# EAGLE design Domino USB MicroSD No Teardrop New (EAGLE 6.5.0)
DATABASE: ./../Common/BOM/Domino_DB.txt; DRAWN: M.STEMPIN; REV: B
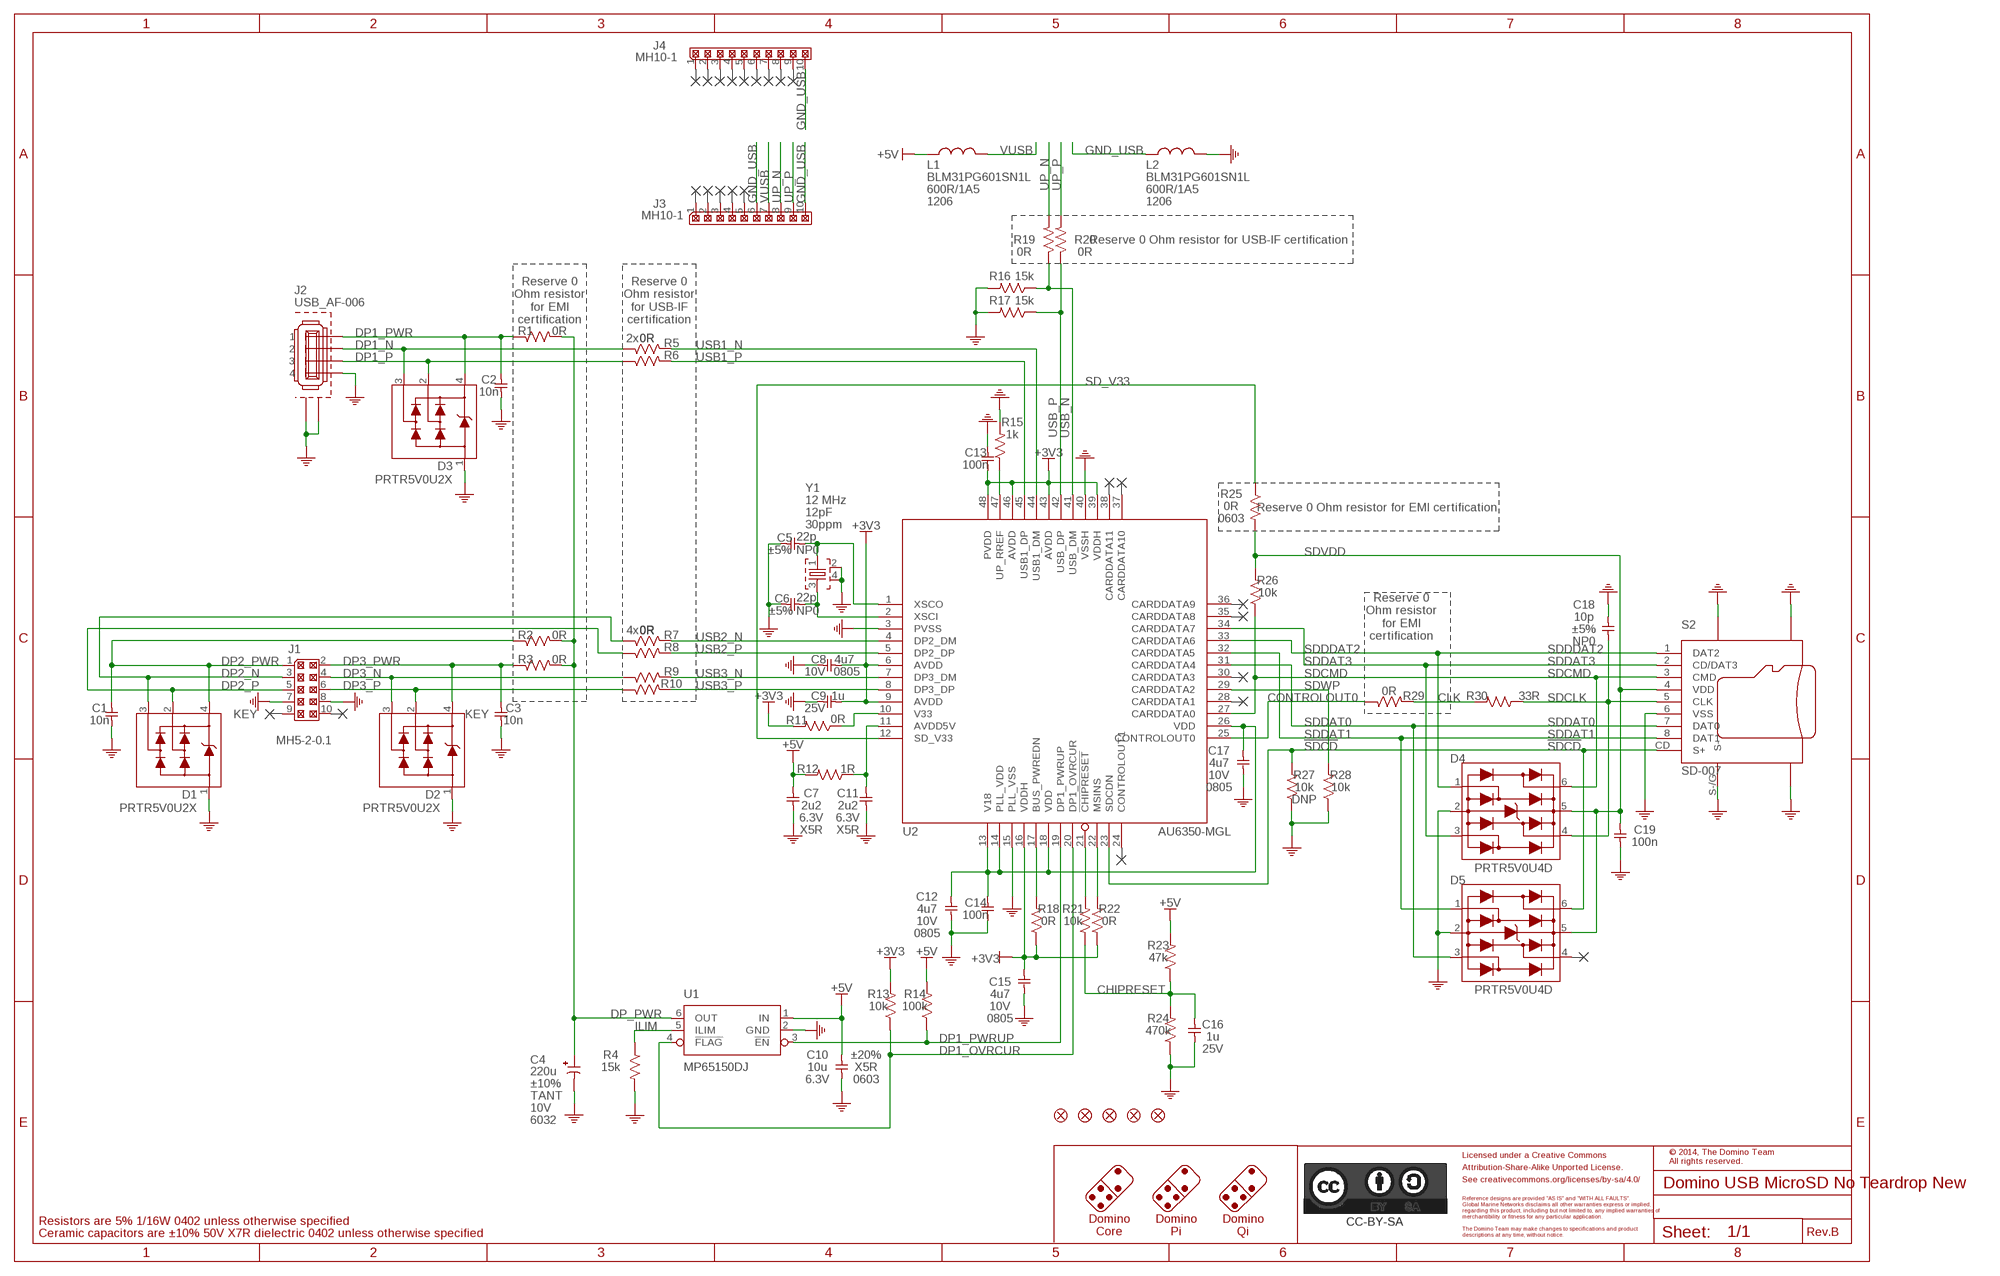
[diagram p0: schematic, sheet 1]
PORT1 (NC): BOM: EXCLUDE
PORT2 (NC): BOM: EXCLUDE
PORT3 (NC): BOM: EXCLUDE
PORT4 (NC): BOM: EXCLUDE
PORT5 (NC): BOM: EXCLUDE
PORT6 (NC): BOM: EXCLUDE
PORT7 (NC): BOM: EXCLUDE
PORT8 (NC): BOM: EXCLUDE
PORT9 (NC): BOM: EXCLUDE
PORT10 (NC): BOM: EXCLUDE
PORT11 (NC): BOM: EXCLUDE
PORT12 (NC): BOM: EXCLUDE
PORT13 (NC): BOM: EXCLUDE
PORT14 (NC): BOM: EXCLUDE
PORT15 (NC): BOM: EXCLUDE
PORT16 (NC): BOM: EXCLUDE
PORT17 (NC): BOM: EXCLUDE
PORT18 (NC): BOM: EXCLUDE
PORT19 (NC): BOM: EXCLUDE
PORT22 (NC): BOM: EXCLUDE
PORT23 (NC): BOM: EXCLUDE
PORT24 (NC): BOM: EXCLUDE
PORT25 (NC): BOM: EXCLUDE
PORT26 (NC): BOM: EXCLUDE

## Parts
C1  10n  CAP_0402  [C0402]
C2  10n  CAP_0402  [C0402]
C3  10n  CAP_0402  [C0402]
C4  220u  CPOL_C/6032-25  [C/6032-25]
C5  22p  CAP_0402  [C0402]
C6  22p  CAP_0402  [C0402]
C7  2u2  CAP_0402  [C0402]
C8  4u7  CAP_0805  [C0805]
C9  1u  CAP_0402  [C0402]
C10  10u  CAP_0603  [C0603]
C11  2u2  CAP_0402  [C0402]
C12  4u7  CAP_0805  [C0805]
C13  100n  CAP_0402  [C0402]
C14  100n  CAP_0402  [C0402]
C15  4u7  CAP_0805  [C0805]
C16  1u  CAP_0402  [C0402]
C17  4u7  CAP_0805  [C0805]
C18  10p  CAP_0402  [C0402]
C19  100n  CAP_0402  [C0402]
CC-BY-SA1  CC-BY-SA_LOGO  [CC-BY-SA_LOGO]
D1  PRTR5V0U2X  [SOT143B]
D2  PRTR5V0U2X  [SOT143B]
D3  PRTR5V0U2X  [SOT143B]
D4  PRTR5V0U4D  [SOT23-6]
D5  PRTR5V0U4D  [SOT23-6]
F1  FIDUCIAL  [FIDUCIAL]
F2  FIDUCIAL  [FIDUCIAL]
F4  FIDUCIAL  [FIDUCIAL]
F5  FIDUCIAL  [FIDUCIAL]
F6  FIDUCIAL  [FIDUCIAL]
J1  MH5-2-0.1  MH5-2  [MH05-2-0.1]
J2  USB_AF-006  [USB_AF-006]
J3  MH10-1  [MH10-1-0.1]
J4  MH10-1  [MH10-1-0.1]
L1  BLM31PG601SN1L  FB_1206  [FB1206]
L2  BLM31PG601SN1L  FB_1206  [FB1206]
R1  0R  RES_0402  [R0402]
R2  0R  RES_0402  [R0402]
R3  0R  RES_0402  [R0402]
R4  15k  RES_0402  [R0402]
R5  0R  RES_0402  [R0402]
R6  0R  RES_0402  [R0402]
R7  0R  RES_0402  [R0402]
R8  0R  RES_0402  [R0402]
R9  0R  RES_0402  [R0402]
R10  0R  RES_0402  [R0402]
R11  0R  RES_0402  [R0402]
R12  1R  RES_0402  [R0402]
R13  10k  RES_0402  [R0402]
R14  100k  RES_0402  [R0402]
R15  1k  RES_0402  [R0402]
R16  15k  RES_0402  [R0402]
R17  15k  RES_0402  [R0402]
R18  0R  RES_0402  [R0402]
R19  0R  RES_0402  [R0402]
R20  0R  RES_0402  [R0402]
R21  10k  RES_0402  [R0402]
R22  0R  RES_0402  [R0402]
R23  47k  RES_0402  [R0402]
R24  470k  RES_0402  [R0402]
R25  0R  RES_0603  [R0603]
R26  10k  RES_0402  [R0402]
R27  10k  RES_0402  [R0402]
R28  10k  RES_0402  [R0402]
R29  0R  RES_0402  [R0402]
R30  33R  RES_0402  [R0402]
S2  SD-007  MICRO-SD  [SD-007]
U1  MP65150DJ  [SOT23-6]
U2  AU6350-MGL  [LQFP-48_7X7]
Y1  12 MHz  CRYSTAL_2SH  [CRYSTAL_32X25]

## Nets
!CHIPRESET: R21.2 U2.21(!CHIPRESET)
!SDCD: D5.6(I/O4) R27.2 S2.CD(S+) U2.23(SDCDN)
+3V3: C8.2 C9.2 C13.2 C15.2 R11.2 R13.2 R18.1 R22.1 U2.6(AVDD) U2.9(AVDD) U2.16(VDDH) U2.39(VDDH) U2.43(AVDD) U2.46(AVDD) U2.48(PVDD)
+5V: C7.1 C10.1 L1.2 R12.2 R14.2 R23.2 U1.1(IN)
AVDD5V: C11.1 R12.1 U2.11(AVDD5V)
BUS_PWREDN: R18.2 U2.17(BUS_PWREDN)
CHIPRESET: C16.1 R21.1 R23.1 R24.2
CLK: R29.2 R30.2
CONTROLOUT0: R29.1 U2.25(CONTROLOUT0)
DP1_N [USB]: D3.3 J2.2 R5.1
DP1_OVRCUR: R13.1 U1.4(!FLAG) U2.20(DP1_OVRCUR)
DP1_P [USB]: D3.2 J2.3 R6.1
DP1_PWR: C2.1 D3.4 J2.1 R1.1
DP1_PWRUP: R14.1 U1.3(!EN) U2.19(DP1_PWRUP)
DP2_N [USB]: D1.3 J1.3 R7.1
DP2_P [USB]: D1.2 J1.5 R8.1
DP2_PWR: C1.1 D1.4 J1.1 R2.1
DP3_N [USB]: D2.3 J1.4 R9.1
DP3_P [USB]: D2.2 J1.6 R10.1
DP3_PWR: C3.1 D2.4 J1.2 R3.1
DP_PWR: C4.1(+) R1.2 R2.2 R3.2 U1.6(OUT)
GND: C1.2 C2.2 C3.2 C4.2(-) C5.1 C6.1 C7.2 C8.1 C9.1 C10.2 C11.2 C12.1 C13.1 C14.2 C15.1 C16.2 C17.1 C18.2 C19.2 D1.1 D2.1 D3.1 D4.2(GND) D5.2(GND) J1.7 J1.8 J2.4 J2.S$1(G) J2.S$2(G) L2.1 R4.2 R15.2 R16.2 R17.2 R24.1 R27.1 R28.1 S2.6(VSS) S2.G$1(G) S2.G$2(G) S2.G$3(G) S2.S-/G(S-) U1.2(GND) U2.3(PVSS) U2.15(PLL_VSS) U2.40(VSSH) Y1.2 Y1.4
GND_USB: J3.6 J3.10 J4.10 L2.2
ILIM: R4.1 U1.5(ILIM)
MSINS: R22.2 U2.22(MSINS)
SD_V33: R25.1 U2.12(SD_V33)
SDCLK: C18.1 D4.4(I/O3) R30.1 S2.5(CLK)
SDCMD: D4.6(I/O4) R26.1 S2.3(CMD) U2.27(CARDDATA0)
SDDAT0: D5.3(I/O2) S2.7(DAT0) U2.31(CARDDATA4)
SDDAT1: D5.1(I/O1) S2.8(DAT1) U2.32(CARDDATA5)
SDDAT3: D4.3(I/O2) S2.2(CD/DAT3) U2.34(CARDDATA7)
SDDDAT2: D4.1(I/O1) S2.1(DAT2) U2.33(CARDDATA6)
SDVDD: C19.1 D4.5(VCC) D5.5(VCC) R25.2 R26.2 S2.4(VDD)
SDWP: R28.2 U2.29(CARDDATA2)
UP_N [USB]: J3.8 R19.2
UP_P [USB]: J3.9 R20.2
UP_PREF: R15.1 U2.47(UP_RREF)
USB1_N [USB]: R5.2 U2.44(USB1_DM)
USB1_P [USB]: R6.2 U2.45(USB1_DP)
USB2_N [USB]: R7.2 U2.4(DP2_DM)
USB2_P [USB]: R8.2 U2.5(DP2_DP)
USB3_N [USB]: R9.2 U2.7(DP3_DM)
USB3_P [USB]: R10.2 U2.8(DP3_DP)
USB_N [USB]: R16.1 R19.1 U2.41(USB_DM)
USB_P [USB]: R17.1 R20.1 U2.42(USB_DP)
V18: C12.2 C14.1 C17.2 U2.13(V18) U2.14(PLL_VDD) U2.18(VDD) U2.26(VDD)
V33: R11.1 U2.10(V33)
VUSB: J3.7 L1.1
XSCI: C6.2 U2.2(XSCI) Y1.3
XSCO: C5.2 U2.1(XSCO) Y1.1
Unconnected: D5.4(I/O3) J1.9 J1.10 J3.1 J3.2 J3.3 J3.4 J3.5 J4.1 J4.2 J4.3 J4.4 J4.5 J4.6 J4.7 J4.8 J4.9 U2.24(CONTROLOUT1) U2.28(CARDDATA1) U2.30(CARDDATA3) U2.35(CARDDATA8) U2.36(CARDDATA9) U2.37(CARDDATA10) U2.38(CARDDATA11)

## Notes on the sheet
- Reserve 0 Ohm resistor for USB-IF certification
- Reserve 0
  Ohm resistor
  for EMI
  certification
- Reserve 0
  Ohm resistor
  for USB-IF
  certification
- 2x
- Reserve 0 Ohm resistor for EMI certification
- Reserve 0
  Ohm resistor
  for EMI
  certification
- 4x
- KEY | KEY
- Licensed under a Creative Commons
- © 2014, The Domino Team
  All rights reserved.
- Attribution-Share-Alike Unported License.
- See creativecommons.org/licenses/by-sa/4.0/
- Reference designs are provided "AS IS" and "WITH ALL FAULTS".
- Global Marine Networks disclaims all other warranties express or implied,
- regarding this product, including but not limited to, any implied warranties of
- merchantibility or fitness for any particular application.
- Resistors are 5% 1/16W 0402 unless otherwise specified
- Domino
  Core
- Domino
  Pi
- Domino
  Qi
- The Domino Team may make changes to specifications and product
- Ceramic capacitors are ±10% 50V X7R dielectric 0402 unless otherwise specified | descriptions at any time, without notice. | Rev.

## Library data of the parts
C1-C3 = Domino:CAP_: Capacitor; PARTNO: C0402_10n_X7R_10%_CER_50V; SIZE: 0402; TC: X7R; TOL: ±10%; TYPE: CER; VOLT: 50V
C4 = Domino:CPOL_?*: Polarized Capacitor; PARTNO: CPOLC-6032_220u_20%_TANT_10V; SIZE: 6032; TOL: ±10%; TYPE: TANT; VOLT: 10V
C5 C6 = Domino:CAP_: Capacitor; PARTNO: C0402_22p_NP0_5%_CER_50V; SIZE: 0402; TC: NP0; TOL: ±5%; TYPE: CER; VOLT: 50V
C7 C11 = Domino:CAP_: Capacitor; PARTNO: C0402_2u2_X5R_10%_CER_6V3; SIZE: 0402; TC: X5R; TOL: ±10%; TYPE: CER; VOLT: 6.3V
C8 C12 C15 C17 = Domino:CAP_: Capacitor; PARTNO: C0805_4u7_X7R_10%_CER_6V3; SIZE: 0805; TC: X7R; TOL: 10%; TYPE: CER; VOLT: 10V
C9 C16 = Domino:CAP_: Capacitor; PARTNO: C0402_1u_X7R_10%_CER_25V; SIZE: 0402; TC: X7R; TOL: ±10%; TYPE: CER; VOLT: 25V
C10 = Domino:CAP_: Capacitor; PARTNO: C0603_10u_X5R_20%_CER_6V3; SIZE: 0603; TC: X5R; TOL: ±20%; TYPE: CER; VOLT: 6.3V
C13 C14 C19 = Domino:CAP_: Capacitor; PARTNO: C0402_100n_X7R_10%_CER_50V; SIZE: 0402; TC: X7R; TOL: ±10%; TYPE: CER; VOLT: 50V
C18 = Domino:CAP_: Capacitor; PARTNO: C0402_10p_NP0_5%_CER_50V; SIZE: 0402; TC: NP0; TOL: ±5%; TYPE: CER; VOLT: 50V
CC-BY-SA1 = Domino:CC-BY-SA_LOGO: Attribution-Share-Alike Unported License See creativecommons.org/licenses/by-sa/3.0/ for details.; BOM: EXCLUDE
D1-D3 = Domino:PRTR5V0U2X: Ultra low capacitance double rail-to-rail ESD protection diode; PARTNO: PRTR5V0U2X
D4 D5 = Domino:PRTR5V0U4D: Ultra low capacitance quadruple rail-to-rail ESD protection; PARTNO: PRTR5V0U4D
F1 F2 F4-F6 = Domino:FIDUCIAL: Fiducial Mark; BOM: EXCLUDE
J1 = Domino:MH5-2: 2x5 Pin Male Header; PARTNO: MH5-2-0.1
J2 = Domino:USB_AF-006: USB-A Right/Angle SMT Connector
J3 J4 = Domino:MH10-1: 10x1 Pin Male Header
L1 L2 = Domino:FB_: Ferrite Bead; OPT: 600R/1A5; PARTNO: BLM31PG601SN1L; SIZE: 1206
R1-R3 R5-R10 R18-R20 R22 R29 = Domino:RES_: Resistor; PARTNO: R0402_0R_5%_62.5mW; RATE: 62.5mW; SIZE: 0402; TOL: 5%
R4 R16 R17 = Domino:RES_: Resistor; PARTNO: R0402_15k_5%_62.5mW; RATE: 62.5mW; SIZE: 0402; TOL: 5%
R11 = Domino:RES_: Resistor; PARTNO: R0402_0R_5%_62.5mW; RATE: 125mW; SIZE: 0402; TOL: 5%
R12 = Domino:RES_: Resistor; PARTNO: R0402_1R_5%_62.5mW; RATE: 62.5mW; SIZE: 0402; TOL: 5%
R13 R21 R26 R28 = Domino:RES_: Resistor; PARTNO: R0402_10k_5%_62.5mW; RATE: 62.5mW; SIZE: 0402; TOL: 5%
R14 = Domino:RES_: Resistor; PARTNO: R0402_100k_5%_62.5mW; RATE: 62.5mW; SIZE: 0402; TOL: 5%
R15 = Domino:RES_: Resistor; PARTNO: R0402_1k_5%_62.5mW; RATE: 62.5mW; SIZE: 0402; TOL: 5%
R23 = Domino:RES_: Resistor; PARTNO: R0402_47k_5%_62.5mW; RATE: 62.5mW; SIZE: 0402; TOL: 5%
R24 = Domino:RES_: Resistor; PARTNO: R0402_470k_5%_62.5mW; RATE: 62.5mW; SIZE: 0402; TOL: 5%
R25 = Domino:RES_: Resistor; PARTNO: R0603_0R_5%_125mW; RATE: 125mW; SIZE: 0603; TOL: 5%
R27 = Domino:RES_: Resistor; DNP: T; PARTNO: R0402_10k_5%_62.5mW; RATE: 62.5mW; SIZE: 0402; TOL: 5%
R30 = Domino:RES_: Resistor; PARTNO: R0402_33R_5%_62.5mW; RATE: 62.5mW; SIZE: 0402; TOL: 5%
S2 = Domino:MICRO-SD: Micro SD Memory Card Connector, With Card Detect Switch; PARTNO: SD-007
U1 = Domino:MP65150DJ: Precision 60mA-1.7A Programmable Current-Limited Power Distribution Switch; PARTNO: MP65150DJ
U2 = Domino:AU6350-MGL: USB2.0 Hub-Reader Controller
Y1 = Domino:CRYSTAL_2SH: Crystal with 2 Shield Pins; LOAD: 12pF; PARTNO: CRYSTAL_32X25_2SH_12PF_30PPM; TOL: 30ppm

## Net classes
1 USB: width 0.368 mm, clearance 0.152 mm to class 0, clearance 0.152 mm
2 PoE: width 0.61 mm, clearance 0.13 mm to class 0, clearance 0.13 mm to class 1, clearance 0.13 mm

## Board
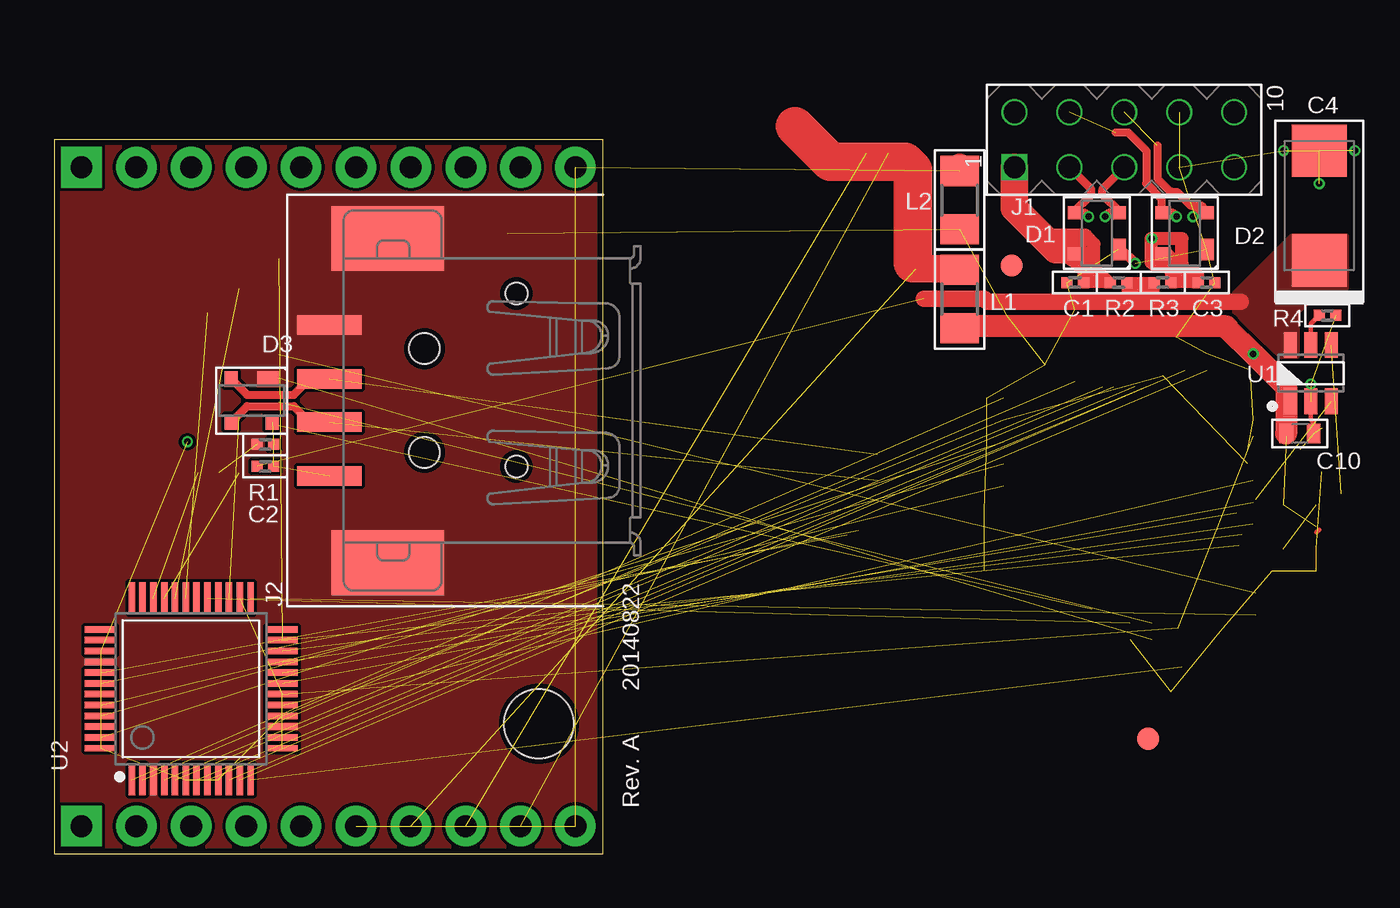
[diagram p1: board, top side]
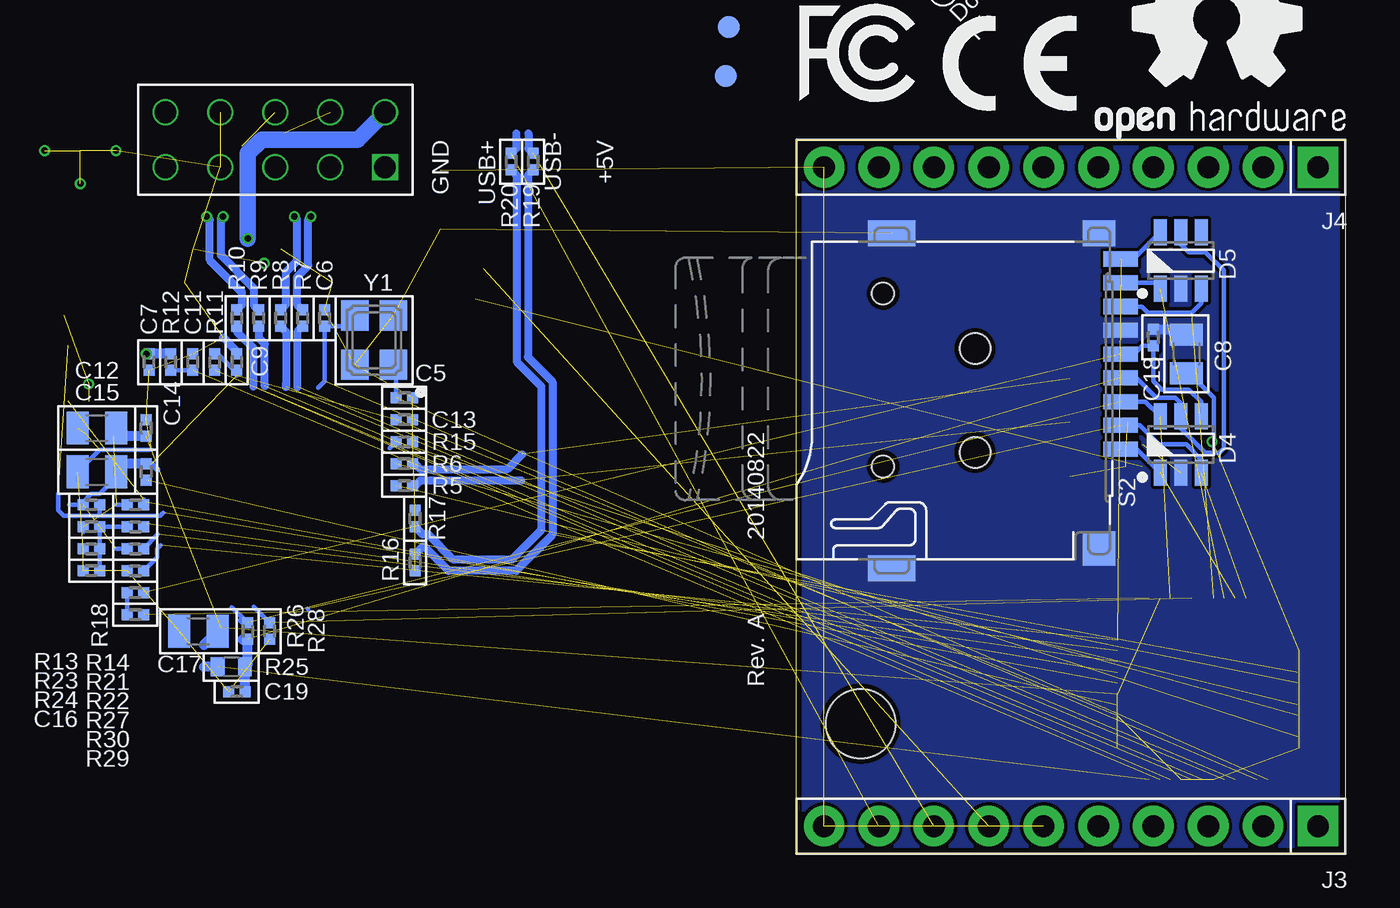
[diagram p2: board, bottom side, seen from below]

Size 25.4 x 33.02 mm. Coordinates in mm from the lower left corner, seen from the top.
Outline: 0,0 25.4,0 25.4,33.02 0,33.02 0,0
Copper layers (1*16): Top 0.043mm / dielectric 1mm / Bottom 0.043mm
Design rules "Domino": minimum track width 0.1mm, minimum drill 0.3mm, track to track 6mil, track to pad 6mil, pad to pad 6mil, via to via 6mil, smd to smd 0mil, copper to edge 0.25mm, drill to drill 0.35mm, minimum pad ring 0.085mm, minimum via ring 0.1mm, stop-mask expansion 0mil, vias tented up to drill 0.45mm, thermal gap 0.2mm
Holes 3.2 mm at 22.44,6

### Footprints (pad centres in the part's own frame; a part is rotated, then mirrored left to right if it is on the bottom)
C0402 = smd 0.508 x 0.508: 1 -0.381,0; 2 0.381,0
C/6032-25 = smd 2.413 x 2.54: 1 -2.54,0; 2 2.54,0
C0805 = smd 1.016 x 1.524: 1 -0.889,0; 2 0.889,0
C0603 = smd 0.635 x 0.889: 1 -0.635,0; 2 0.635,0
SOT143B = smd 1 x 0.7: 1 -0.75,-1 | smd 0.6 x 0.7: 2 0.95,-1; 3 0.95,1; 4 -0.95,1
SOT23-6 = smd 0.6 x 1.2: 1 -0.95,-1.3; 2 0,-1.3; 3 0.95,-1.3; 4 0.95,1.3; 5 0,1.3; 6 -0.95,1.3
FIDUCIAL = smd 1.016 x 1.016: 1 0,0
MH05-2-0.1 = drill 1 square: 1 -1.27,5.08 | drill 1: 2 1.27,5.08; 3 -1.27,2.54; 4 1.27,2.54; 5 -1.27,0; 6 1.27,0; 7 -1.27,-2.54; 8 1.27,-2.54; 9 -1.27,-5.08; 10 1.27,-5.08
USB_AF-006 = smd 0.9 x 3: 1 -3.5,4.4; 2 -1,4.4; 3 1,4.4; 4 3.5,4.4 | smd 3 x 5.2: S$1 -7.5,1.7; S$2 7.5,1.7 | hole 1.4: -2.4,0; 2.4,0
MH10-1-0.1 = drill 1.016 pad 1.88 square: 1 0,0 | drill 1.016 pad 1.88: 2 2.54,0; 3 5.08,0; 4 7.62,0; 5 10.16,0; 6 12.7,0; 7 15.24,0; 8 17.78,0; 9 20.32,0; 10 22.86,0
FB1206 = smd 1.4 x 1.8: 1 -1.35,0; 2 1.35,0
R0402 = smd 0.508 x 0.508: 1 -0.381,0; 2 0.381,0
R0603 = smd 0.635 x 0.889: 1 -0.635,0; 2 0.635,0
SD-007 = smd 0.7 x 1.6: 1 2.25,15; 2 1.15,15; 3 0.05,15; 4 -1.05,15; 5 -2.15,15; 6 -3.25,15; 7 -4.35,15; 8 -5.45,15; CD -6.55,15 | smd 1.6 x 1.5: G$1 6.85,14 | smd 1.2 x 2.2: G$2 7.75,4.4; G$3 -7.75,4.4 | smd 1.2 x 1.5: S-/G -7.75,14 | hole 1: -4.95,4; 3.05,4
LQFP-48_7X7 = smd 1.45 x 0.3: 1 -4.2,2.75; 2 -4.2,2.25; 3 -4.2,1.75; 4 -4.2,1.25; 5 -4.2,0.75; 6 -4.2,0.25; 7 -4.2,-0.25; 8 -4.2,-0.75; 9 -4.2,-1.25; 10 -4.2,-1.75; 11 -4.2,-2.25; 12 -4.2,-2.75; 25 4.2,-2.75; 26 4.2,-2.25; 27 4.2,-1.75; 28 4.2,-1.25; 29 4.2,-0.75; 30 4.2,-0.25; 31 4.2,0.25; 32 4.2,0.75; 33 4.2,1.25; 34 4.2,1.75; 35 4.2,2.25; 36 4.2,2.75 | smd 0.3 x 1.45: 13 -2.75,-4.2; 14 -2.25,-4.2; 15 -1.75,-4.2; 16 -1.25,-4.2; 17 -0.75,-4.2; 18 -0.25,-4.2; 19 0.25,-4.2; 20 0.75,-4.2; 21 1.25,-4.2; 22 1.75,-4.2; 23 2.25,-4.2; 24 2.75,-4.2; 37 2.75,4.2; 38 2.25,4.2; 39 1.75,4.2; 40 1.25,4.2; 41 0.75,4.2; 42 0.25,4.2; 43 -0.25,4.2; 44 -0.75,4.2; 45 -1.25,4.2; 46 -1.75,4.2; 47 -2.25,4.2; 48 -2.75,4.2
CRYSTAL_32X25 = smd 1.27 x 1.397: 1 -0.889,1.143; 2 -0.889,-1.143; 3 0.889,-1.143; 4 0.889,1.143

### Placement (x,y rotation side)
C1  47.24,26.42 180 top  (outside the outline)
C2  9.78,18.92 180 top
C3  53.34,26.42 0 top  (outside the outline)
C4  58.55,29.97 90 top  (outside the outline)
C5  43.56,21.08 180 bottom  (outside the outline)
C6  47.24,24.77 270 bottom  (outside the outline)
C7  55.37,22.73 270 bottom  (outside the outline)
C8  7.37,23.11 270 bottom
C9  51.31,22.73 270 bottom  (outside the outline)
C10  57.66,19.43 0 top  (outside the outline)
C11  53.34,22.73 90 bottom  (outside the outline)
C12  57.78,19.68 0 bottom  (outside the outline)
C13  43.56,20.07 180 bottom  (outside the outline)
C14  55.5,19.68 90 bottom  (outside the outline)
C15  57.78,17.65 0 bottom  (outside the outline)
C16  58.04,13.08 180 bottom  (outside the outline)
C17  53.09,10.29 0 bottom  (outside the outline)
C18  8.89,23.88 90 bottom
C19  51.31,7.49 180 bottom  (outside the outline)
CC-BY-SA1  -5.08,-50.8 0 top  (outside the outline)
D1  48.26,28.7 90 top  (outside the outline)
D2  52.32,28.7 90 top  (outside the outline)
D3  9.14,20.95 180 top
D4  7.62,18.92 0 bottom
D5  7.62,27.43 0 bottom
DRILEGEND  [DRILEGEND]  81.53,59.94 0 top  (outside the outline)
F1  50.63,5.31 0 top  (outside the outline)
F2  44.32,27.21 0 top  (outside the outline)
F4  27.88,40.37 0 bottom  (outside the outline)
F5  28.67,35.97 0 bottom  (outside the outline)
F6  28.54,38.24 0 bottom  (outside the outline)
J1  49.53,33.02 90 top  (outside the outline)
J2  17.14,20.95 90 top
J3  1.27,1.27 180 bottom
J4  1.27,31.75 180 bottom
L1  41.91,25.65 270 top  (outside the outline)
L2  41.91,30.23 90 top  (outside the outline)
R1  9.78,17.91 180 top
R2  49.28,26.42 0 top  (outside the outline)
R3  51.31,26.42 180 top  (outside the outline)
R4  58.93,24.89 0 top  (outside the outline)
R5  43.56,17.02 180 bottom  (outside the outline)
R6  43.56,18.03 180 bottom  (outside the outline)
R7  48.26,24.77 270 bottom  (outside the outline)
R8  49.28,24.77 270 bottom  (outside the outline)
R9  50.29,24.77 270 bottom  (outside the outline)
R10  51.31,24.77 270 bottom  (outside the outline)
R11  52.32,22.73 90 bottom  (outside the outline)
R12  54.36,22.73 90 bottom  (outside the outline)
R13  58.04,16.13 180 bottom  (outside the outline)
R14  56.01,16.13 180 bottom  (outside the outline)
R15  43.56,19.05 0 bottom  (outside the outline)
R16  43.05,13.46 270 bottom  (outside the outline)
R17  43.05,15.49 90 bottom  (outside the outline)
R18  55.5,17.65 270 bottom  (outside the outline)
R19  37.59,32 90 bottom  (outside the outline)
R20  38.61,32 90 bottom  (outside the outline)
R21  56.01,15.11 0 bottom  (outside the outline)
R22  56.01,14.1 0 bottom  (outside the outline)
R23  58.04,15.11 180 bottom  (outside the outline)
R24  58.04,14.1 0 bottom  (outside the outline)
R25  51.56,8.64 0 bottom  (outside the outline)
R26  50.8,10.29 270 bottom  (outside the outline)
R27  56.01,13.08 0 bottom  (outside the outline)
R28  49.78,10.29 90 bottom  (outside the outline)
R29  56.01,11.05 180 bottom  (outside the outline)
R30  56.01,12.06 180 bottom  (outside the outline)
S2  25.4,20.95 270 bottom
U1  58.17,22.23 0 top  (outside the outline)
U2  6.35,7.62 90 top
U$3  [A5L-LOC]  -55.88,-62.23 0 top  (outside the outline)
U$4  [DOMINO_LOGO_SMALL]  17.73,41.65 0 bottom  (outside the outline)
U$13  [CE_LOGO_SMALL]  18.64,34.35 0 bottom
U$15  [FCC_LOGO_SMALL]  25.27,34.83 0 bottom
U$16  [OPEN_HARDWARE_LOGO]  5.96,38.52 0 bottom  (outside the outline)
Y1  44.96,23.75 180 bottom  (outside the outline)

### Tracks (layer width: path | path; a pad name or v marks a point on that pad's centre or on a via)
!CHIPRESET  (1 unrouted)
  Bottom 0.203: 55.48,15.26 R21.2
!SDCD  (2 unrouted)
  Bottom 0.203: 54.83,14.26 54.99,14.1 54.99,13.72 R27.2 | D5.6 9.8,27.5 S2.CD
+3V3  (via drill 0.3 pad 0.03)  (11 unrouted)
  Bottom 0.203: R22.1 56.9,14.1 | 59.05,16.13 R13.2 58.42,16.26 58.04,16.64 57.66,16.64 57.02,17.27 57.02,17.53 C15.2 | 51.31,22.1 C9.2 51.44,22.35 52.2,23.11 R11.2 52.5,23.11 | 7.24,22.23 6.1,21.08 6.1,19.13 v6.17,19.05
  Bottom 0.254: R18.1 55.24,18.03 54.97,17.76
  Bottom 0.457: C8.2 7.24,22.23 7.11,22.23 | R18.1 56.52,18.03 C15.2
+5V  (via drill 0.3 pad 0.03)  (3 unrouted)
  Top 0.203: 58.42,14.86 58.55,14.99 | 56.58,22.67 56.26,22.35
  Top 0.457: L1.2 41.96,24.3
  Top 0.61: 57.22,21.4 U1.1 57.22,20.13 57.02,19.94 C10.1 57.02,19.3
  Top 1.016: 56.26,22.35 v55.5,23.11 54.31,24.3 54.31,24.33 54.25,24.38 41.99,24.38 L1.2 | 56.26,22.35 56.33,22.29 | 56.33,22.29 57.02,21.59 C10.1 | 56.26,22.35 56.33,22.35 56.33,22.29
  Bottom 0.203: R14.2 56.9,16.13 | R23.2 58.42,14.86
  Bottom 0.457: R12.2 C7.1 v55.5,23.11
AVDD5V  (1 unrouted)
  Bottom 0.203: R12.1 C11.1 53.34,22.33
BUS_PWREDN  (1 unrouted)
  Bottom 0.203: 55.49,17.26 R18.2
CHIPRESET
  Bottom 0.203: R21.1 R23.1 R24.2 C16.1
CLK
  Bottom 0.203: R29.2 R30.2
CONTROLOUT0  (1 unrouted)
DP1_N  (1 unrouted)
  Top 0.368: D3.3 8.93,20.7 11.1,20.7 11.84,19.95 J2.2
  Bottom 0.368: 38.13,17.27 42.8,17.27 43.05,17.02 R5.1
DP1_OVRCUR  (2 unrouted)
  Bottom 0.203: 54.73,15.76 54.86,15.62 57.66,15.62 | R13.1 57.66,15.62 | 57.66,15.62 59.31,15.62 59.56,15.88 59.56,16.64
DP1_P  (1 unrouted)
  Top 0.368: D3.2 8.93,21.21 11.1,21.21 11.84,21.95 J2.3
  Bottom 0.368: R6.1 43.07,18.03 42.82,17.79 38.78,17.79 38.1,18.47
DP1_PWR  (3 unrouted)
DP1_PWRUP  (2 unrouted)
  Bottom 0.203: 55.49,16.26 R14.1 55.63,16.38
DP2_N  (via drill 0.3 pad 0.03)
  Top 0.368: v47.88,29.46 47.68,29.66 D1.3 47.18,29.66 48,30.48 48,30.74 J1.3
  Bottom 0.368: v47.88,29.46 48,29.34 48,27.2 48.51,26.69 48.51,25.39 R7.1
DP2_P  (via drill 0.3 pad 0.03)
  Top 0.368: v48.64,29.46 48.84,29.66 D1.2 49.34,29.66 48.52,30.48 48.52,30.74 J1.5
  Bottom 0.368: v48.64,29.46 48.52,29.34 48.52,27.41 49.03,26.91 49.03,25.39 R8.1
DP2_PWR
  Top 0.508: 48.13,27.18 R2.1 47.88,26.42 47.62,26.67 | D1.4 47.16,27.39 47.62,26.92 | 47.62,26.92 47.88,27.18 47.88,26.8 48.26,26.42 | C1.1 47.62,26.67 | 47.62,26.67 47.62,26.92
  Top 0.61: 48.13,27.18 48.13,28.19 47.75,28.57 47.7,28.52
  Top 0.762: 47.62,28.45 47.7,28.52 46.18,28.52
  Top 1.27: J1.1 44.45,29.84 46.35,27.94 46.96,27.94 D1.4
DP3_N  (via drill 0.3 pad 0.03)  (1 unrouted)
  Top 0.368: v51.94,29.46 51.74,29.66 D2.3 51.25,29.69 51.25,30.3 50.54,31.01 50.54,32.53 50.53,32.53 49.71,33.35 49.12,33.35
  Bottom 0.368: v51.94,29.46 52.04,29.37 52.04,27.67 50.52,26.15 50.52,25.38 R9.1
DP3_P  (via drill 0.3 pad 0.03)  (1 unrouted)
  Top 0.368: v52.7,29.46 52.9,29.66 D2.2 53.11,29.97 52.6,29.97 51.97,30.61 51.69,30.61 51.63,30.66 51.62,30.66 51.06,31.22 51.06,32.75
  Bottom 0.368: v52.7,29.46 52.56,29.32 52.56,27.45 51.08,25.97 51.08,25.38 R10.1
DP3_PWR  (via drill 0.3 pad 0.03)
  Top 0.508: C3.1 R3.1 51.69,26.92 51.44,27.18 50.93,27.18 50.77,27.33 | 52.07,27.3 52.45,26.92 52.83,26.92 52.96,26.8 52.96,26.67 52.07,26.67 52.07,27.18 52.2,27.3
  Top 0.61: 52.2,27.3 52.2,28.45 v50.8,28.45 50.77,28.45 50.77,27.33 | D2.4 51.51,27.74 52.07,27.18
  Bottom 0.762: J1.2 45.72,33.02 50.16,33.02 50.8,32.38 v50.8,28.45
DP_PWR  (1 unrouted)
  Top 0.508: R3.2 R2.2 49.66,25.78 50.93,25.78 50.93,26.16 49.91,26.16 49.91,25.45 | 57.22,23.56 U1.6
  Top 0.61: 50.93,25.78 50.93,25.53
  Top 0.762: 40.26,25.65 43.05,25.65 43.19,25.52 50.92,25.52 50.93,25.53 54.93,25.53
  pour Top (no thermals): 54.61,25.02 54.61,25.91 57.28,28.57 59.82,28.57 59.82,26.16 58.67,26.16 57.53,25.02 57.53,22.99 56.77,22.99
GND  (via drill 0.3 pad 0.03)  (35 unrouted)
  Top 0.203: C10.2 58.29,19.94 58.17,20.07 U1.2
  Top 0.457: D1.1 49.4,27.94 v50.04,27.3
  Bottom 0.203: 55.24,18.67 57.66,18.67 C15.1
  Bottom 0.368: C9.1 51.31,23.24 51.94,23.88
  Bottom 0.457: C18.2 7.62,24.26 C8.1
  other vias: 58.17,21.72 60.2,32.51 56.9,32.51 58.55,30.99
  pour Top (rank 2, no thermals): 0,33.02 25.4,33.02 25.4,0 0,0
  pour Bottom (no thermals): 0,33.02 25.4,33.02 25.4,0 0,0
GND_USB  (3 unrouted)
  Top 1.016: 41.91,31.88 L2.2
ILIM
  Top 0.203: U1.5 58.17,24.51 R4.1
MSINS  (1 unrouted)
  Bottom 0.203: 54.96,14.76 R22.2
SD_V33  (1 unrouted)
  Bottom 0.457: R25.1 52.83,8.64
SDCLK  (1 unrouted)
  Bottom 0.203: D4.4 6.67,20.89 7.24,21.46 8.51,21.46 8.89,21.84 C18.1 9.4,23.5 9.79,23.11 S2.5
SDCMD  (2 unrouted)
  Bottom 0.203: 51.53,11.4 R26.1 51.05,10.67 51.18,10.79 | D4.6 9.25,20.91 S2.3
SDDAT0  (1 unrouted)
  Bottom 0.203: D5.3 6.67,25.46 7.11,25.02 9.14,25.02 9.43,25.3 S2.7
SDDAT1  (1 unrouted)
  Bottom 0.203: S2.8 8.84,26.41 D5.1
SDDAT3  (2 unrouted)
  Bottom 0.203: 48.03,11.33 48.01,11.3 | D4.3 6.67,18.23 7.37,18.92 8.64,18.92 9.52,19.8 S2.2
SDDDAT2  (1 unrouted)
  Bottom 0.203: D4.1 9.65,18.7 S2.1
SDVDD  (1 unrouted)
  Bottom 0.203: D5.5 7.62,28.19 7.24,27.81 6.48,27.81 5.64,26.98 5.64,18.75 5.84,18.54 6.48,18.54 7.62,19.68 D4.5 7.62,20.83 7.87,21.08 8.76,21.08 9.69,22 S2.4
  Bottom 0.457: C19.1 R25.2 50.8,8.76 R26.2 51.05,9.91
SDWP  (1 unrouted)
  Bottom 0.203: 50.53,11.42 R28.2
UP_N  (1 unrouted)
  Bottom 0.368: 37.81,33.31 37.81,32.61 R19.2
UP_P  (1 unrouted)
  Bottom 0.368: 38.38,33.3 38.38,32.61 R20.2
UP_PREF  (1 unrouted)
  Bottom 0.203: 44.23,18.76 R15.1
USB1_N  (1 unrouted)
USB1_P  (1 unrouted)
USB2_N  (1 unrouted)
  Bottom 0.254: 48.53,21.56 48.51,21.59
  Bottom 0.368: R7.2 48.51,24.13 48.51,21.59
USB2_P  (1 unrouted)
  Bottom 0.254: 49.03,21.71 49.03,21.72
  Bottom 0.368: 49.03,24.14 | 49.03,24.14 49.03,24.13 49.03,21.72 49.03,21.59 | R8.2 49.03,24.14
USB3_N  (1 unrouted)
  Bottom 0.254: 50.03,21.59 50.01,21.62
  Bottom 0.368: 50.01,21.62 50.01,23.58 50.29,23.86 R9.2
USB3_P  (1 unrouted)
  Bottom 0.368: 50.53,21.6 50.53,23.37 51.31,24.14 R10.2
USB_N  (1 unrouted)
  Bottom 0.368: R19.1 37.84,31.38 37.84,22.97 36.7,21.82 36.7,14.75 38.37,13.07 41.51,13.07 42.63,14.19 42.7,14.19 R16.1
USB_P  (1 unrouted)
  Bottom 0.368: R17.1 42.7,14.76 42.46,14.76 41.29,13.6 38.59,13.6 37.22,14.97 37.22,21.61 38.36,22.75 38.36,31.38 R20.1
V18  (5 unrouted)
  Bottom 0.254: 52.03,10.45 C17.2
  Bottom 0.457: C14.1 56.52,19.3 C12.2 | 52.83,9.65 C17.2
V33  (1 unrouted)
VUSB  (1 unrouted)
  Top 0.762: L1.1 41.91,27.05
  Top 1.27: 42.12,27.05 41.91,27.05 39.88,27.05 39.88,27.3 39.75,27.3
  Top 1.778: 34.29,33.66 35.94,32 39.37,32 39.75,31.62 39.75,27.3
XSCI  (1 unrouted)
  Bottom 0.203: Y1.3 46.35,24.38 C6.2 47.24,21.84 47.53,21.55
XSCO  (1 unrouted)
  Bottom 0.203: C5.2 43.94,22.48 Y1.1

### Text on the board
bPlace: +5V | USB- | GND | USB+
tNames: Rev. A
bNames: Rev. A
Document: DRILL CHART: TOP TO BOTTOM | LINE WIDTH IMPEDANCE CHART FOR REFERENCE | Class | USB | Type | Diff Coated Coplanar Waveguide With Ground 1B | Layer | Impedance | Trace Width | Trace Separation | Ground Separation | TOP, / BOTTOM | 90 Ohms | 14.5 mils | 6 mils | 6 mils | STACK-UP FOR REFERENCE | LAYER 1 L1 TOP | 18 UM CU + 12.5 UM PLATING (30.5 UM) | 1.061 MM+/-10% | CORE | 1.0 MM CORE FR-4 LG 135 / INCLUDING COPPER | LAYER 4 L16 BOTTOM | 18 UM CU + 12.5 UM PLATING (30.5 UM) | NOTES: | 1. PRINTED CIRCUIT BOARD MADE FROM NEMA GRADE FR-4 TG 135 EPOXY / LAMINATE WITH 18 UM COPPER PLATING AND 1 MM THICKNESS. | 2. ALL DIMENSIONS ARE GIVEN IN MILLIMETERS EXCEPT TRACE WIDTH/SPACE. | 3. CIRCUIT PATHS ARE FOR REFERENCE ONLY. | 4. HOLE SIZES SHOWN ARE FINISHED DIAMETERS AFTER PLATING. | 5. BOARD PLATED USING REFLOW OR SIMILAR METHOD. | 6. BOARD TO HAVE WHITE SOLDER MASK ON PLATED SURFACES USING WET / FILM SR100 OR SR1010 EPOXY. / EQUIVALENT WET OR DRY FILM MAY BE USED. | 7. SILKSCREEN BOARD USING BLACK INK. DISTORTION OF SILKSCREEN / IS ACCEPTABLE OVER TRACES. EPOXY INK ON PLATED LANDS IS NOT / ACCEPTABLE | 8. THE FOLLOWING INFORMATION APPLIES TO THIS BOARD: | * 2 COPPER LAYERS | * 1 MM BOARD THICKNESS | * REQUIRES TOP AND BOTTOM SIDE SILKSCREENS | © 2014, The Domino Team. / All rights reserved. | Licensed under a Creative Commons / Attribution-Share-Alike Unported License. / See creativecommons.org/licenses/by-sa/4.0/ | Reference designs are provided "AS IS" and "WITH ALL FAULTS". / The Domino Team disclaims all other warranties express or implied, / regarding this product, including but not limited to, any implied warranties of / merchantibility or fitness for any particular application. | Domino / Core | Domino / Pi | Domino / Qi | The Domino Team may make changes to specifications and product descriptions / at any time, without notice. | Rev.
DrillLegend: LAYER-STACK
DrillLegend_01-16: 01-16
DrillLegend_01-20: 01-20
Pinout: USB3_PWR | USB3- | USB3+ | GND | KEY | +5V | USB- | USB+ | GND | USB2_PWR | USB2- | USB2+ | GND | KEY | Pinout (.PIN)
Component_side: Component Side (.CMP)
Solder_side: Solder side (.SOL)
Silk_screen_CMP: Silk screen CMP (.PLC)
Silk_screen_SOL: Silk screen SOL (.PLS)
Solder_stop_mask_CMP: Solder stop mask CMP (.STC)
Solder_stop_mask_SOL: Solder stop mask SOL (.STS)
Cream_frame_CMP: Cream frame CMP (.CRC)
Cream_frame_SOL: Cream frame SOL (.CRS)
Drill_data: Drill data (.DRD)
Component_Assembly_CMP: Component Assembly CMP (.ASC)
Component_Assembly_SOL: Component Assembly SOL (.ASS)
Outline: Outline (.OLN)